# Altium project MiniPC MB GOST.PrjPcb (part 1 of 31)
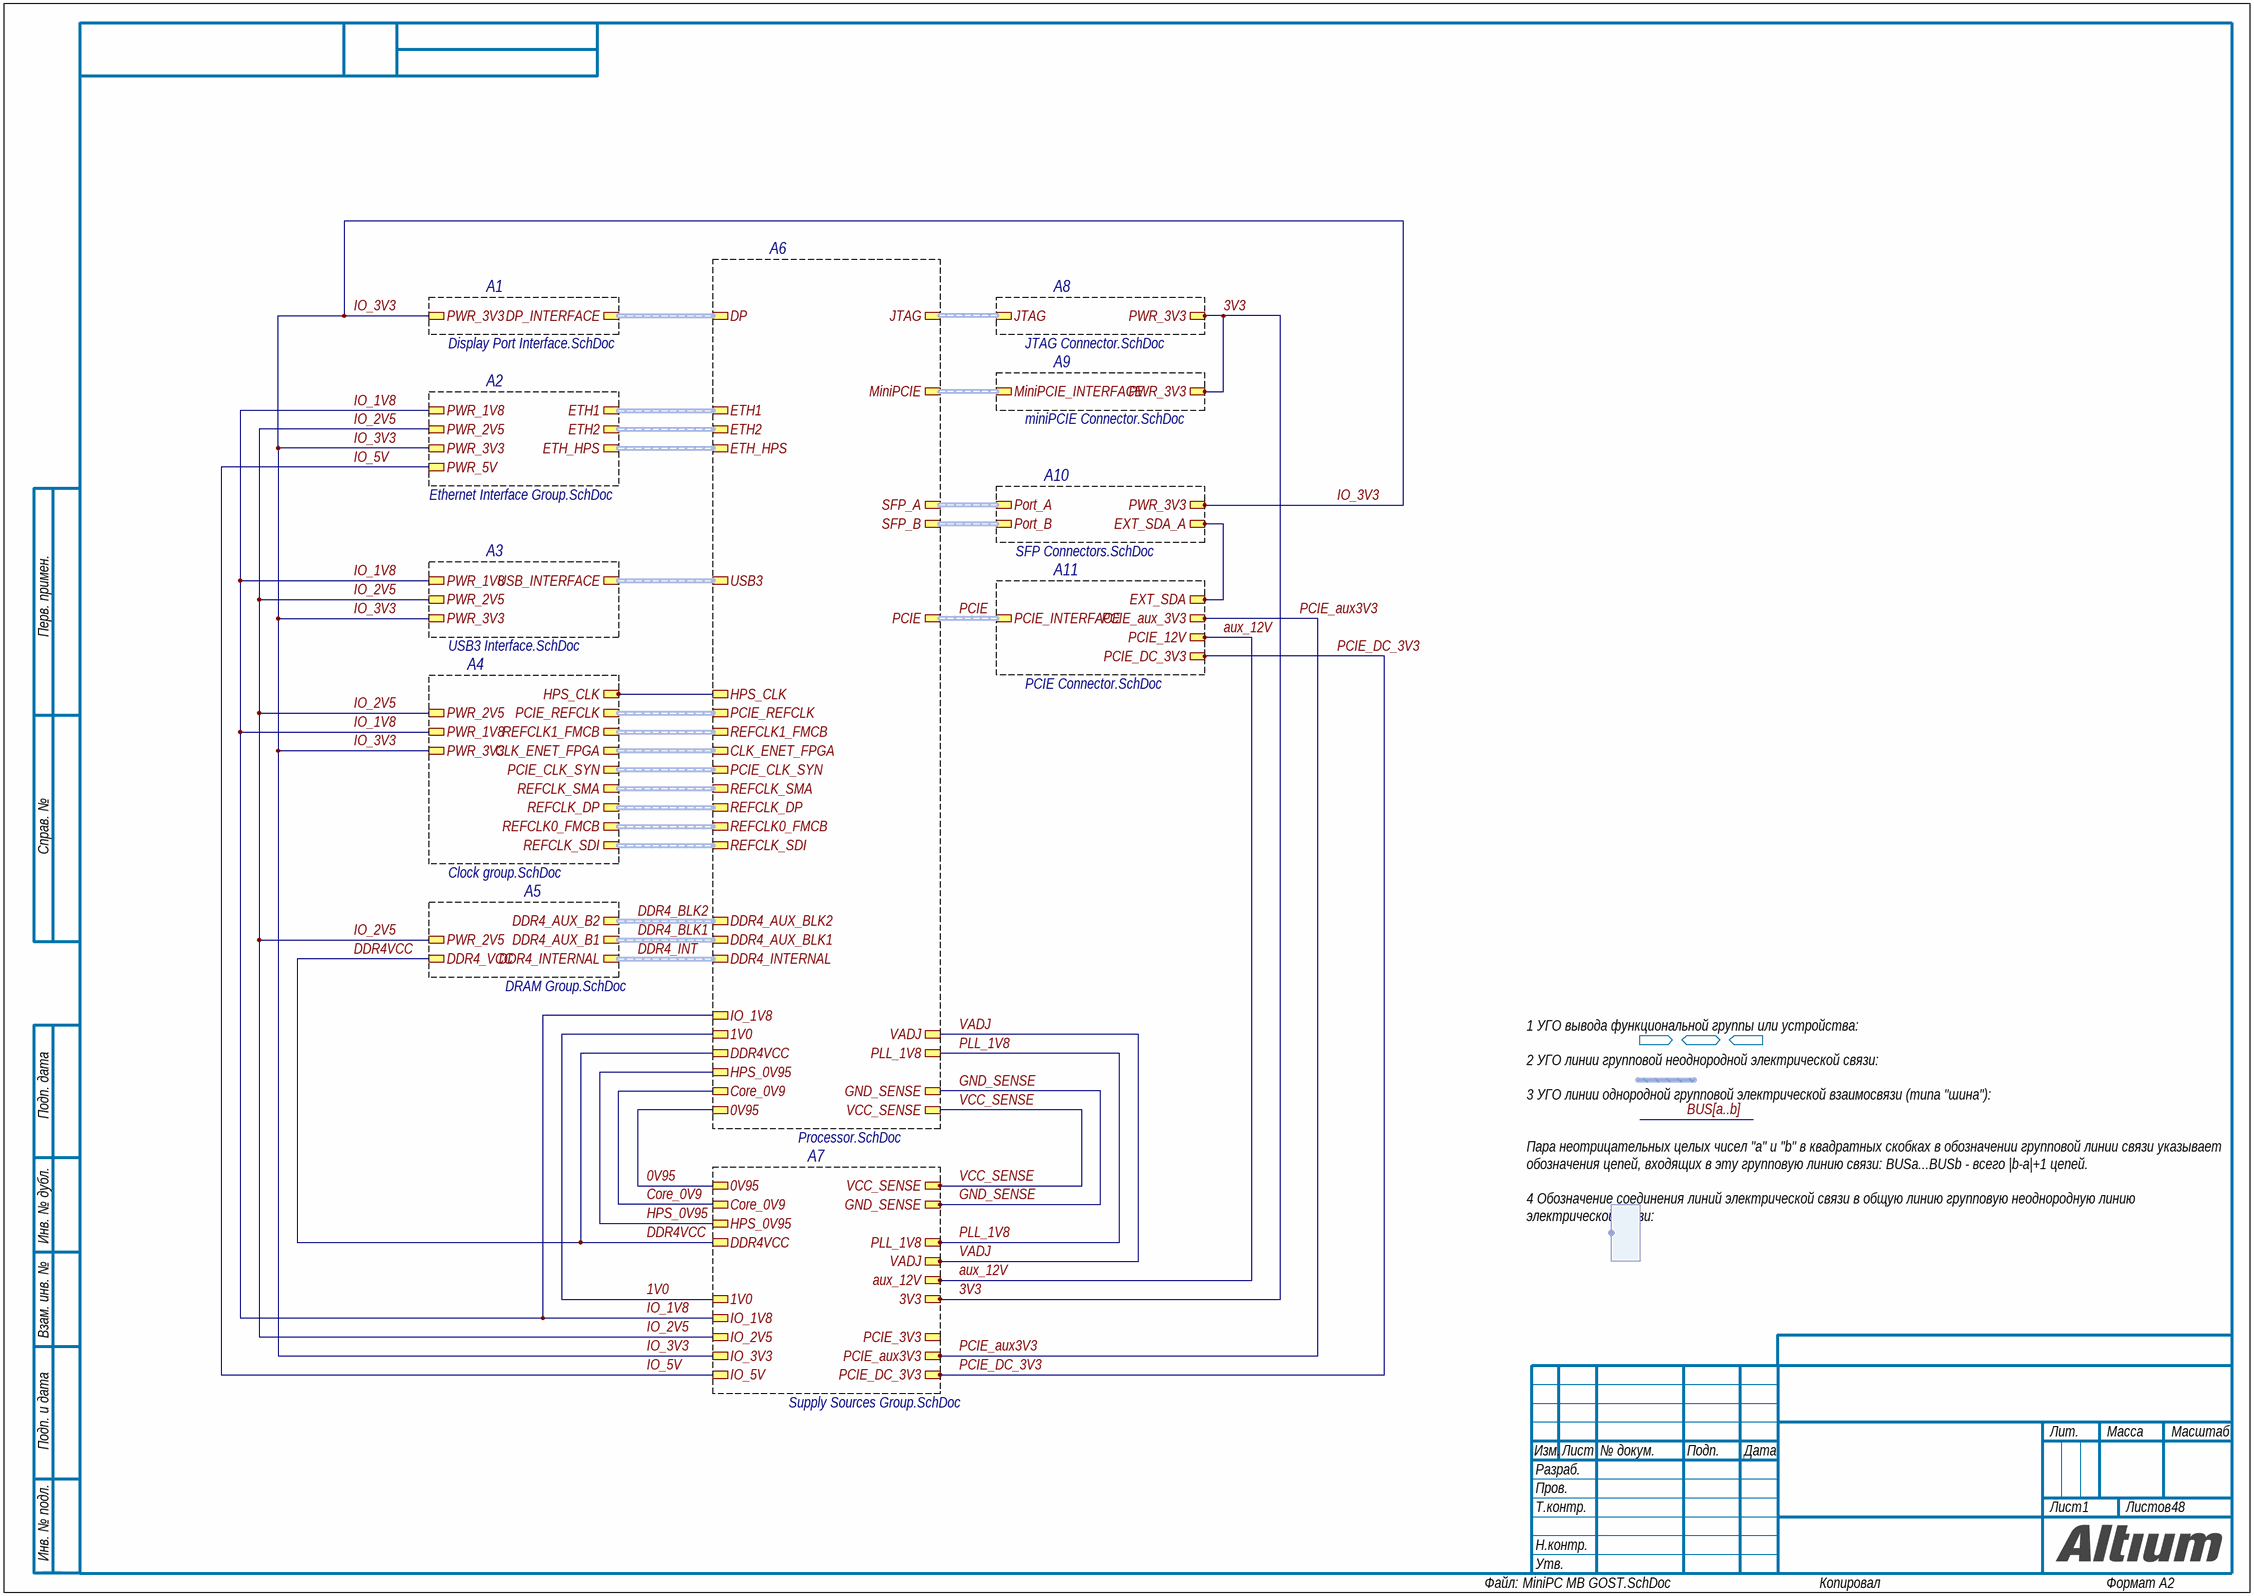
[diagram p0: MiniPC MB GOST.SchDoc]
Âèä_äîêóìåíòà_SCH: Ñõåìà ýëåêòðè÷åñêàÿ ïðèíöèïèàëüíàÿ; Êîä_äîêóìåíòà_SCH: Ý3; Ëèòåðà: Î; Íàèìåíîâàíèå: MiniPC Îñíîâíàÿ ïëàòà; Íàèìåíîâàíèå1: MiniPC Îñíîâíàÿ ïëàòà; Íàèìåíîâàíèå_PCB: MiniPC Îñíîâíàÿ ïëàòà; Обозначение: 495.604.1585; Обозначение_PCB: 495.604.1585; Обозначение_Код: 495.604.1585Ý3; Указания_изменение: -; Указания_изменение_ПЭ3: -; Ôîðìàò_PCB: À4, À3, À2; ï_Í_êîíòð_Ð: Íîðìà÷åâ; ï_Ïðîâ_Ð: Ïðîâåðîâ; ï_Ðàçðàá_Ð: Ðàçðàáîâ; ï_Óòâ_Ð: Óòâåðæäóí
45 sheets, 1002 parts. Net scope: hierarchical (ports join the sheet entries above them; power ports are global).
Board file: MiniPC.PcbDoc
Sheets:
  MiniPC MB GOST.SchDoc
    A5 = DRAM Group.SchDoc
      AB14 = DRAM DDR4 bank 1 Connector.SchDoc
      AB13 = DRAM DDR4.SchDoc
      AB15 = DRAM DDR4 Bank 2 Connector.SchDoc
    A7 = Supply Sources Group.SchDoc
      AB23 = Converter 12V-3V3.SchDoc
      AB32 = Converter 12V-0V9.SchDoc
      AB35 = Converter 12V-5V.SchDoc
      AB24 = Supply Switches 12V 3V3 1V8.SchDoc
      AB34 = Supply Driver 12V.SchDoc
      AB36 = Supply Swithes 2V5-1V8.SchDoc
      AB30 = Converter 3V3-1V8.SchDoc
      AB28 = Converter 3V3-0V9 V1.SchDoc
      AB31 = Converter 3V3-2V5.SchDoc
      AB27 = Converter 3V3-1V.SchDoc
      AB25 = Converter 3V3-VADJ.SchDoc
      AB26 = Converter 3V3-DDR4VCC.SchDoc
      AB33 = Supply Switches for 3V3 externals.SchDoc
      AB29 = Converter 3V3-0V9 V2.SchDoc
    A2 = Ethernet Interface Group.SchDoc
      AB19 = Ethernet Interface.SchDoc
        AC1 = Ethernet Connector.SchDoc
      AB21 = Ethernet HPS Interface.SchDoc
        AC2 = Ethernet HPS Connector.SchDoc
      AB20 = Ethernet Interface.SchDoc
        AC1 = Ethernet Connector.SchDoc
    A8 = JTAG Connector.SchDoc
    A9 = miniPCIE Connector.SchDoc
    A11 = PCIE Connector.SchDoc
    A4 = Clock group.SchDoc
    A1 = Display Port Interface.SchDoc
      AB16 = DisplayPort Connector.SchDoc
    A10 = SFP Connectors.SchDoc
      AB17 = SFP Connector.SchDoc
      AB18 = SFP Connector.SchDoc
    A3 = USB3 Interface.SchDoc
      AB22 = USB3 Connector.SchDoc
  Core Supply Filter.SchDoc
  IO Supply Filter.SchDoc
  P_RAM_integr.SchDoc
  P_RAM_aux.SchDoc
  P_DP_REFCLK_SFP.SchDoc
  P_JTAG_EEPROM.SchDoc
  P_USB.SchDoc
  P_MiniPCIE.SchDoc
  P_PCIE_ETH.SchDoc
  P_ETH_HPS.SchDoc

## Sheet MiniPC MB GOST.SchDoc
size 594 x 420 mm; AdditionFace: Рук.проекта; AdditionFaceBy: Сидоров; StandartControlBy: Смирнов; Letter1: {Э}; DocumentType: Схема электрическая принципиальная; Title1: {Наименование}; Title2: {Наименование}; GroupNumber: {ХХХХ.000000.001-01}; PageSetup: Record=PageOptions|CenterHorizontal=True|CenterVertical=True|PrintScale=1.00|XCorrection=1.00|YCorrection=1.00|PrintKind=2|BorderSize=5000000|LeftOffset=0|BottomOffset=0|Orientation=2|PaperLength=1000|PaperWidth=1000|Scale=100|PaperSource=7|PrintQuality=-3|MediaType=1|DitherType=10|PrintScaleMode=1|PaperKind=A4|PaperIndex=9; Author: ALTIUM GOSTBOM2.0 KEV; SheetNumber: 1; SheetTotal: 48

### Sub-sheets
A1 = Display Port Interface.SchDoc: DP_INTERFACE (harness DP_INTERFACE), PWR_3V3
A2 = Ethernet Interface Group.SchDoc: PWR_1V8, ETH1 (harness ETHERNET), ETH2 (harness ETHERNET), PWR_2V5, PWR_5V, PWR_3V3, ETH_HPS (harness ETHERNET_HPS)
A3 = USB3 Interface.SchDoc: PWR_1V8, USB_INTERFACE (harness USB3), PWR_3V3, PWR_2V5
A4 = Clock group.SchDoc: REFCLK1_FMCB (harness DIFFPAIR), PCIE_REFCLK (harness DIFFPAIR), HPS_CLK, PWR_3V3, CLK_ENET_FPGA (harness DIFFPAIR), PCIE_CLK_SYN (harness DIFFPAIR), REFCLK_SMA (harness DIFFPAIR), REFCLK_DP (harness DIFFPAIR), REFCLK0_FMCB (harness DIFFPAIR), PWR_1V8, REFCLK_SDI (harness DIFFPAIR), PWR_2V5
A5 = DRAM Group.SchDoc: DDR4_INTERNAL (harness DDR4_2C), DDR4_VCC, PWR_2V5, DDR4_AUX_B1 (harness DDR4_SODIMM), DDR4_AUX_B2 (harness DDR4_SODIMM)
A6 = Processor.SchDoc (file not in this document): 0V95, Core_0V9, HPS_0V95, DDR4VCC, 1V0, IO_1V8, VCC_SENSE, GND_SENSE, PLL_1V8, VADJ, DP (harness DP_INTERFACE), ETH1 (harness ETHERNET), ETH2 (harness ETHERNET), ETH_HPS (harness ETHERNET_HPS), PCIE_REFCLK (harness DIFFPAIR), REFCLK1_FMCB (harness DIFFPAIR), CLK_ENET_FPGA (harness DIFFPAIR), PCIE_CLK_SYN (harness DIFFPAIR), REFCLK_SMA (harness DIFFPAIR), REFCLK_DP (harness DIFFPAIR), REFCLK0_FMCB (harness DIFFPAIR), REFCLK_SDI (harness DIFFPAIR), DDR4_AUX_BLK2 (harness DDR4_SODIMM), DDR4_AUX_BLK1 (harness DDR4_SODIMM), DDR4_INTERNAL (harness DDR4_2C), PCIE (harness PCIE), SFP_B (harness SFP), SFP_A (harness SFP), MiniPCIE (harness MiniPCIE), JTAG (harness JTAG), HPS_CLK, USB3 (harness USB3)
A7 = Supply Sources Group.SchDoc: 0V95, PCIE_3V3, VCC_SENSE, GND_SENSE, aux_12V, 1V0, IO_1V8, PLL_1V8, VADJ, PCIE_aux3V3, PCIE_DC_3V3, Core_0V9, IO_2V5, IO_5V, HPS_0V95, DDR4VCC, IO_3V3, 3V3
A8 = JTAG Connector.SchDoc: JTAG (harness JTAG), PWR_3V3
A9 = miniPCIE Connector.SchDoc: PWR_3V3, MiniPCIE_INTERFACE (harness MiniPCIE)
A10 = SFP Connectors.SchDoc: Port_A (harness SFP), EXT_SDA_A, Port_B (harness SFP), PWR_3V3
A11 = PCIE Connector.SchDoc: PCIE_12V, PCIE_DC_3V3, EXT_SDA, PCIE_INTERFACE (harness PCIE), PCIE_aux_3V3

### Harnesses
111: 

### Nets
0V95: sheet A6/0V95, sheet A7/0V95
1V0: sheet A6/1V0, sheet A7/1V0
3V3: sheet A7/3V3, sheet A8/PWR_3V3, sheet A9/PWR_3V3
aux_12V: sheet A7/aux_12V, sheet A11/PCIE_12V
Core_0V9: sheet A6/Core_0V9, sheet A7/Core_0V9
DDR4VCC: sheet A6/DDR4VCC, sheet A5/DDR4_VCC, sheet A7/DDR4VCC
EXT_SDA: sheet A11/EXT_SDA, sheet A10/EXT_SDA_A
GND_SENSE: sheet A6/GND_SENSE, sheet A7/GND_SENSE
HPS_0V95: sheet A6/HPS_0V95, sheet A7/HPS_0V95
IO_1V8: sheet A6/IO_1V8, sheet A7/IO_1V8, sheet A2/PWR_1V8, sheet A4/PWR_1V8, sheet A3/PWR_1V8
IO_2V5: sheet A5/PWR_2V5, sheet A7/IO_2V5, sheet A2/PWR_2V5, sheet A4/PWR_2V5, sheet A3/PWR_2V5
IO_3V3: sheet A7/IO_3V3, sheet A2/PWR_3V3, sheet A4/PWR_3V3, sheet A1/PWR_3V3, sheet A10/PWR_3V3, sheet A3/PWR_3V3
IO_5V: sheet A7/IO_5V, sheet A2/PWR_5V
PCIE_aux3V3: sheet A7/PCIE_aux3V3, sheet A11/PCIE_aux_3V3
PCIE_DC_3V3: sheet A7/PCIE_DC_3V3, sheet A11/PCIE_DC_3V3
PLL_1V8: sheet A6/PLL_1V8, sheet A7/PLL_1V8
VADJ: sheet A6/VADJ, sheet A7/VADJ
VCC_SENSE: sheet A6/VCC_SENSE, sheet A7/VCC_SENSE
NetD5_1: sheet A6/HPS_CLK, sheet A4/HPS_CLK

### Buses and harness runs
bus BUS[a..b]
harness DDR4_BLK1 = sheet A5/DDR4_AUX_B1 = sheet A6/DDR4_AUX_BLK1
harness DDR4_BLK2 = sheet A5/DDR4_AUX_B2 = sheet A6/DDR4_AUX_BLK2
harness DDR4_INT = sheet A5/DDR4_INTERNAL = sheet A6/DDR4_INTERNAL
harness PCIE = sheet A6/PCIE = sheet A11/PCIE_INTERFACE
harness sheet A1/DP_INTERFACE = sheet A6/DP
harness sheet A2/ETH1 = sheet A6/ETH1
harness sheet A2/ETH2 = sheet A6/ETH2
harness sheet A2/ETH_HPS = sheet A6/ETH_HPS
harness sheet A3/USB_INTERFACE = sheet A6/USB3
harness sheet A4/CLK_ENET_FPGA = sheet A6/CLK_ENET_FPGA
harness sheet A4/PCIE_CLK_SYN = sheet A6/PCIE_CLK_SYN
harness sheet A4/PCIE_REFCLK = sheet A6/PCIE_REFCLK
harness sheet A4/REFCLK0_FMCB = sheet A6/REFCLK0_FMCB
harness sheet A4/REFCLK1_FMCB = sheet A6/REFCLK1_FMCB
harness sheet A4/REFCLK_DP = sheet A6/REFCLK_DP
harness sheet A4/REFCLK_SDI = sheet A6/REFCLK_SDI
harness sheet A4/REFCLK_SMA = sheet A6/REFCLK_SMA
harness sheet A6/JTAG = sheet A8/JTAG
harness sheet A6/MiniPCIE = sheet A9/MiniPCIE_INTERFACE
harness sheet A6/SFP_A = sheet A10/Port_A
harness sheet A6/SFP_B = sheet A10/Port_B

### Notes on the sheet
- 1 УГО вывода функциональной группы или устройства:
  2 УГО линии групповой неоднородной электрической связи:
  3 УГО линии однородной групповой электрической взаимосвязи (типа "шина"):
  Пара неотрицательных целых чисел "a" и "b" в квадратных скобках в обозначении групповой линии связи указывает обозначения цепей, входящих в эту групповую линию связи: BUSa...BUSb - всего |b-a|+1 цепей.
  4 Обозначение соединения линий электрической связи в общую линию групповую неоднородную линию электрической связи:
  5 Основная надпись листов схемы по форме 1 ГОСТ 2.104-2006 (согласно п.5.1 ГОСТ 2.104-2006).
- Перв. примен.
- Справ. №
- Подп. дата
- Инв. № дубл.
- Взам. инв. №
- Подп. и дата
- Изм.
- Разраб.
- Лист
- № докум.
- Подп.
- Дата
- Лит.
- Масса
- Масштаб
- Пров.
- Т.контр.
- Листов
- Инв. № подл.
- Н.контр.
- Утв.
- ALTIUM GOSTBOM2.0 KEV
- Файл:
- Копировал
- Формат А2

## Sheet DRAM Group.SchDoc
size 209 x 297 mm; Author: ALTIUM GOSTBOM2.0 KEV; SheetNumber: 5; SheetTotal: 48
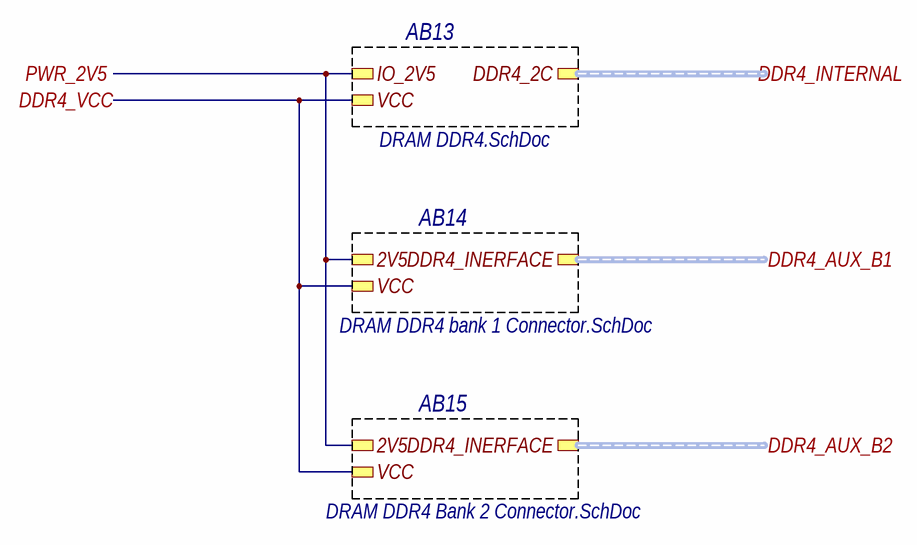
[diagram p1: DRAM Group.SchDoc]

### Sub-sheets
AB13 = DRAM DDR4.SchDoc: VCC, IO_2V5, DDR4_2C (harness DDR4_2C)
AB14 = DRAM DDR4 bank 1 Connector.SchDoc: VCC, DDR4_INERFACE (harness DDR4_SODIMM), 2V5
AB15 = DRAM DDR4 Bank 2 Connector.SchDoc: VCC, DDR4_INERFACE (harness DDR4_SODIMM), 2V5

### Ports
DDR4_AUX_B1 (harness DDR4_SODIMM), DDR4_AUX_B2 (harness DDR4_SODIMM), DDR4_INTERNAL (harness DDR4_2C), DDR4_VCC, PWR_2V5

### Nets
DDR4VCC: port DDR4_VCC, sheet AB14/VCC, sheet AB13/VCC, sheet AB15/VCC
IO_2V5: port PWR_2V5, sheet AB14/2V5, sheet AB13/IO_2V5, sheet AB15/2V5

### Buses and harness runs
harness port DDR4_AUX_B1 = sheet AB14/DDR4_INERFACE
harness port DDR4_AUX_B2 = sheet AB15/DDR4_INERFACE
harness port DDR4_INTERNAL = sheet AB13/DDR4_2C

### Notes on the sheet
- Подп. дата
- Инв. № дубл.
- Взам. инв. №
- Подп. и дата
- Инв. № подл.
- Изм.
- Лист
- № докум.
- Подп.
- Дата
- Файл:
- ALTIUM GOSTBOM2.0 KEV
- Копировал
- Формат А4

## Sheet DRAM DDR4 bank 1 Connector.SchDoc
size 594 x 420 mm; Author: ALTIUM GOSTBOM2.0 KEV; SheetNumber: 6; SheetTotal: 48
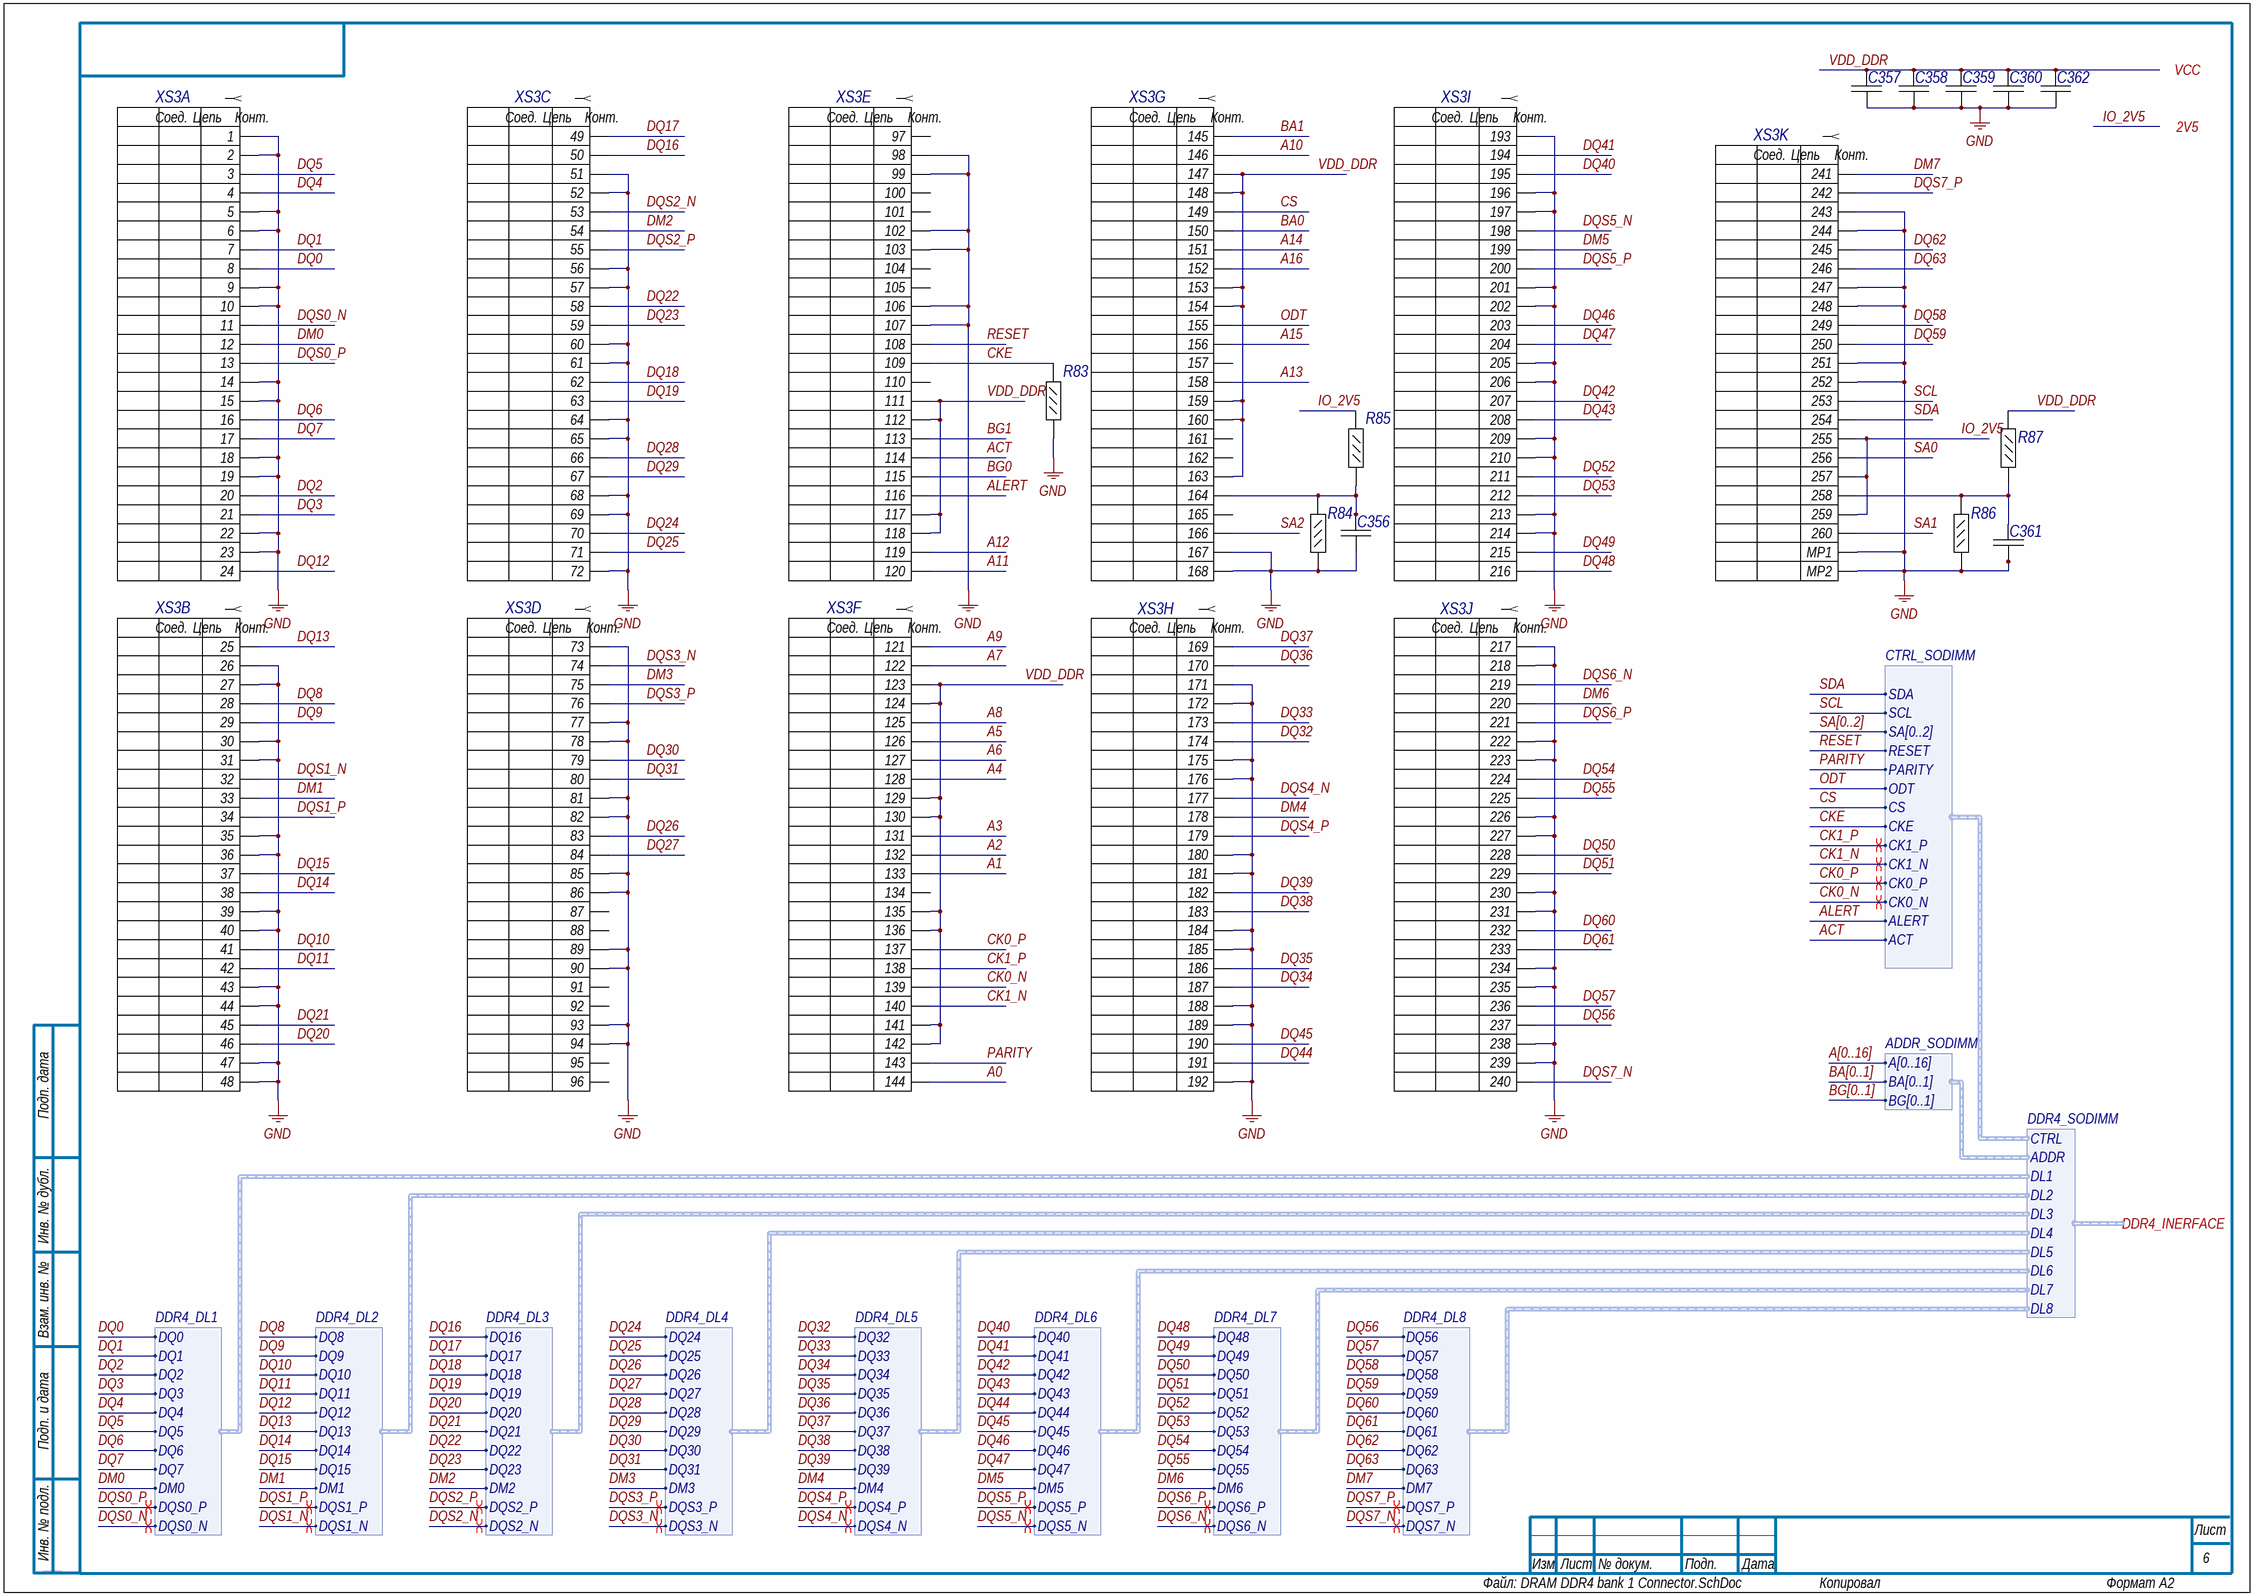
[diagram p2: DRAM DDR4 bank 1 Connector.SchDoc]

### Parts
C356  C1005X7R1E104M  [CAPC1005X55X10LL05]  (value not drawn)
C357  C1005X7R1E104M  [CAPC1005X55X10LL05]  (value not drawn)
C358  C1005X7R1E104M  [CAPC1005X55X10LL05]  (value not drawn)
C359  C1005X7R1E104M  [CAPC1005X55X10LL05]  (value not drawn)
C360  C1005X7R1E104M  [CAPC1005X55X10LL05]  (value not drawn)
C361  C1005X7R1E104M  [CAPC1005X55X10LL05]  (value not drawn)
C362  C1005X7R1E104M  [CAPC1005X55X10LL05]  (value not drawn)
R83  RC0402JR-0739RL  [RESC1005X40X25LL05T05]  (value not drawn)
R84  RC0402JR-0739RL  [RESC1005X40X25LL05T05]  (value not drawn)
R85  RC0402JR-0739RL  [RESC1005X40X25LL05T05]  (value not drawn)
R86  RC0402JR-0739RL  [RESC1005X40X25LL05T05]  (value not drawn)
R87  RC0402JR-0739RL  [RESC1005X40X25LL05T05]  (value not drawn)
XS3  AS0A823-H8SB-7H  [FOXC-AS0A823-H8SB-7H_V]  (value not drawn)  (parts A,B,C,D,E,F,G,H,I,J,K of 11)

### Ports
2V5, DDR4_INERFACE (harness DDR4_SODIMM), VCC

### Harnesses
DDR4_DL1: DQ0, DQ1, DQ2, DQ3, DQ4, DQ5, DQ6, DQ7, DM0, DQS0_P, DQS0_N
DDR4_DL2: DQ8, DQ9, DQ10, DQ11, DQ12, DQ13, DQ14, DQ15, DM1, DQS1_P, DQS1_N
DDR4_DL3: DQ16, DQ17, DQ18, DQ19, DQ20, DQ21, DQ22, DQ23, DM2, DQS2_P, DQS2_N
DDR4_DL4: DQ24, DQ25, DQ26, DQ27, DQ28, DQ29, DQ30, DQ31, DM3, DQS3_P, DQS3_N
DDR4_DL5: DQ32, DQ33, DQ34, DQ35, DQ36, DQ37, DQ38, DQ39, DM4, DQS4_P, DQS4_N
DDR4_DL6: DQ40, DQ41, DQ42, DQ43, DQ44, DQ45, DQ46, DQ47, DM5, DQS5_P, DQS5_N
DDR4_DL7: DQ48, DQ49, DQ50, DQ51, DQ52, DQ53, DQ54, DQ55, DM6, DQS6_P, DQS6_N
DDR4_DL8: DQ56, DQ57, DQ58, DQ59, DQ60, DQ61, DQ62, DQ63, DM7, DQS7_P, DQS7_N
DDR4_SODIMM: CTRL, ADDR, DL1, DL2, DL3, DL4, DL5, DL6, DL7, DL8
ADDR_SODIMM: A[0..16], BA[0..1], BG[0..1]
CTRL_SODIMM: SDA, SCL, SA[0..2], RESET, PARITY, ODT, CS, CKE, CK1_P, CK1_N, CK0_P, CK0_N, ALERT, ACT

### Nets
GND: C356.1 C357.2 C358.2 C359.2 C360.2 C361.2 C362.2 R83.1 R84.1 R86.1 XS3.1 XS3.2 XS3.5 XS3.6 XS3.9 XS3.10 XS3.14 XS3.15 XS3.18 XS3.19 XS3.22 XS3.23 XS3.26 XS3.27 XS3.30 XS3.31 XS3.35 XS3.36 XS3.39 XS3.40 XS3.43 XS3.44 XS3.47 XS3.48 XS3.51 XS3.52 XS3.56 XS3.57 XS3.60 XS3.61 XS3.64 XS3.65 XS3.68 XS3.69 XS3.72 XS3.73 XS3.77 XS3.78 XS3.81 XS3.82 XS3.85 XS3.86 XS3.89 XS3.90 XS3.93 XS3.94 XS3.98 XS3.99 XS3.102 XS3.103 XS3.106 XS3.107 XS3.167 XS3.168 XS3.171 XS3.172 XS3.175 XS3.176 XS3.180 XS3.181 XS3.184 XS3.185 XS3.188 XS3.189 XS3.192 XS3.193 XS3.196 XS3.197 XS3.201 XS3.202 XS3.205 XS3.206 XS3.209 XS3.210 XS3.213 XS3.214 XS3.217 XS3.218 XS3.222 XS3.223 XS3.226 XS3.227 XS3.230 XS3.231 XS3.234 XS3.235 XS3.238 XS3.239 XS3.243 XS3.244 XS3.247 XS3.248 XS3.251 XS3.252 XS3.MP1 XS3.MP2
A0: XS3.144  [project net A0_6]
A1: XS3.133  [project net A1_6]
A2: XS3.132  [project net A2_6]
A3: XS3.131  [project net A3_6]
A4: XS3.128  [project net A4_6]
A5: XS3.126  [project net A5_6]
A6: XS3.127  [project net A6_6]
A7: XS3.122  [project net A7_6]
A8: XS3.125  [project net A8_6]
A9: XS3.121  [project net A9_6]
A10: XS3.146  [project net A10_6]
A11: XS3.120  [project net A11_6]
A12: XS3.119  [project net A12_6]
A13: XS3.158  [project net A13_6]
A14: XS3.151  [project net A14_6]
A15: XS3.156  [project net A15_6]
A16: XS3.152  [project net A16_6]
ACT: XS3.114 ; harness CTRL_SODIMM.ACT
ALERT: XS3.116 ; harness CTRL_SODIMM.ALERT
BA0: XS3.150  [project net BA0_6]
BA1: XS3.145  [project net BA1_6]
BG0: XS3.115  [project net BG0_6]
BG1: XS3.113  [project net BG1_6]
CK0_N: XS3.139 ; harness CTRL_SODIMM.CK0_N
CK0_P: XS3.137 ; harness CTRL_SODIMM.CK0_P
CK1_N: XS3.140 ; harness CTRL_SODIMM.CK1_N
CK1_P: XS3.138 ; harness CTRL_SODIMM.CK1_P
CKE: R83.2 XS3.109 ; harness CTRL_SODIMM.CKE
CS: XS3.149 ; harness CTRL_SODIMM.CS
DM0: XS3.12 ; harness DDR4_DL1.DM0
DM1: XS3.33 ; harness DDR4_DL2.DM1
DM2: XS3.54 ; harness DDR4_DL3.DM2
DM3: XS3.75 ; harness DDR4_DL4.DM3
DM4: XS3.178 ; harness DDR4_DL5.DM4
DM5: XS3.199 ; harness DDR4_DL6.DM5
DM6: XS3.220 ; harness DDR4_DL7.DM6
DM7: XS3.241 ; harness DDR4_DL8.DM7
DQ0: XS3.8 ; harness DDR4_DL1.DQ0
DQ1: XS3.7 ; harness DDR4_DL1.DQ1
DQ2: XS3.20 ; harness DDR4_DL1.DQ2
DQ3: XS3.21 ; harness DDR4_DL1.DQ3
DQ4: XS3.4 ; harness DDR4_DL1.DQ4
DQ5: XS3.3 ; harness DDR4_DL1.DQ5
DQ6: XS3.16 ; harness DDR4_DL1.DQ6
DQ7: XS3.17 ; harness DDR4_DL1.DQ7
DQ8: XS3.28 ; harness DDR4_DL2.DQ8
DQ9: XS3.29 ; harness DDR4_DL2.DQ9
DQ10: XS3.41 ; harness DDR4_DL2.DQ10
DQ11: XS3.42 ; harness DDR4_DL2.DQ11
DQ12: XS3.24 ; harness DDR4_DL2.DQ12
DQ13: XS3.25 ; harness DDR4_DL2.DQ13
DQ14: XS3.38 ; harness DDR4_DL2.DQ14
DQ15: XS3.37 ; harness DDR4_DL2.DQ15
DQ16: XS3.50 ; harness DDR4_DL3.DQ16
DQ17: XS3.49 ; harness DDR4_DL3.DQ17
DQ18: XS3.62 ; harness DDR4_DL3.DQ18
DQ19: XS3.63 ; harness DDR4_DL3.DQ19
DQ20: XS3.46 ; harness DDR4_DL3.DQ20
DQ21: XS3.45 ; harness DDR4_DL3.DQ21
DQ22: XS3.58 ; harness DDR4_DL3.DQ22
DQ23: XS3.59 ; harness DDR4_DL3.DQ23
DQ24: XS3.70 ; harness DDR4_DL4.DQ24
DQ25: XS3.71 ; harness DDR4_DL4.DQ25
DQ26: XS3.83 ; harness DDR4_DL4.DQ26
DQ27: XS3.84 ; harness DDR4_DL4.DQ27
DQ28: XS3.66 ; harness DDR4_DL4.DQ28
DQ29: XS3.67 ; harness DDR4_DL4.DQ29
DQ30: XS3.79 ; harness DDR4_DL4.DQ30
DQ31: XS3.80 ; harness DDR4_DL4.DQ31
DQ32: XS3.174 ; harness DDR4_DL5.DQ32
DQ33: XS3.173 ; harness DDR4_DL5.DQ33
DQ34: XS3.187 ; harness DDR4_DL5.DQ34
DQ35: XS3.186 ; harness DDR4_DL5.DQ35
DQ36: XS3.170 ; harness DDR4_DL5.DQ36
DQ37: XS3.169 ; harness DDR4_DL5.DQ37
DQ38: XS3.183 ; harness DDR4_DL5.DQ38
DQ39: XS3.182 ; harness DDR4_DL5.DQ39
DQ40: XS3.195 ; harness DDR4_DL6.DQ40
DQ41: XS3.194 ; harness DDR4_DL6.DQ41
DQ42: XS3.207 ; harness DDR4_DL6.DQ42
DQ43: XS3.208 ; harness DDR4_DL6.DQ43
DQ44: XS3.191 ; harness DDR4_DL6.DQ44
DQ45: XS3.190 ; harness DDR4_DL6.DQ45
DQ46: XS3.203 ; harness DDR4_DL6.DQ46
DQ47: XS3.204 ; harness DDR4_DL6.DQ47
DQ48: XS3.216 ; harness DDR4_DL7.DQ48
DQ49: XS3.215 ; harness DDR4_DL7.DQ49
DQ50: XS3.228 ; harness DDR4_DL7.DQ50
DQ51: XS3.229 ; harness DDR4_DL7.DQ51
DQ52: XS3.211 ; harness DDR4_DL7.DQ52
DQ53: XS3.212 ; harness DDR4_DL7.DQ53
DQ54: XS3.224 ; harness DDR4_DL7.DQ54
DQ55: XS3.225 ; harness DDR4_DL7.DQ55
DQ56: XS3.237 ; harness DDR4_DL8.DQ56
DQ57: XS3.236 ; harness DDR4_DL8.DQ57
DQ58: XS3.249 ; harness DDR4_DL8.DQ58
DQ59: XS3.250 ; harness DDR4_DL8.DQ59
DQ60: XS3.232 ; harness DDR4_DL8.DQ60
DQ61: XS3.233 ; harness DDR4_DL8.DQ61
DQ62: XS3.245 ; harness DDR4_DL8.DQ62
DQ63: XS3.246 ; harness DDR4_DL8.DQ63
DQS0_N: XS3.11 ; harness DDR4_DL1.DQS0_N
DQS0_P: XS3.13 ; harness DDR4_DL1.DQS0_P
DQS1_N: XS3.32 ; harness DDR4_DL2.DQS1_N
DQS1_P: XS3.34 ; harness DDR4_DL2.DQS1_P
DQS2_N: XS3.53 ; harness DDR4_DL3.DQS2_N
DQS2_P: XS3.55 ; harness DDR4_DL3.DQS2_P
DQS3_N: XS3.74 ; harness DDR4_DL4.DQS3_N
DQS3_P: XS3.76 ; harness DDR4_DL4.DQS3_P
DQS4_N: XS3.177 ; harness DDR4_DL5.DQS4_N
DQS4_P: XS3.179 ; harness DDR4_DL5.DQS4_P
DQS5_N: XS3.198 ; harness DDR4_DL6.DQS5_N
DQS5_P: XS3.200 ; harness DDR4_DL6.DQS5_P
DQS6_N: XS3.219 ; harness DDR4_DL7.DQS6_N
DQS6_P: XS3.221 ; harness DDR4_DL7.DQS6_P
DQS7_N: XS3.240 ; harness DDR4_DL8.DQS7_N
DQS7_P: XS3.242 ; harness DDR4_DL8.DQS7_P
IO_2V5: R85.1 XS3.255 XS3.257 XS3.259 ; port 2V5
ODT: XS3.155 ; harness CTRL_SODIMM.ODT
PARITY: XS3.143 ; harness CTRL_SODIMM.PARITY
RESET: XS3.108 ; harness CTRL_SODIMM.RESET
SA0: XS3.256  [project net SA0_6]
SA1: XS3.260  [project net SA1_6]
SA2: XS3.166  [project net SA2_6]
SCL: XS3.253 ; harness CTRL_SODIMM.SCL
SDA: XS3.254 ; harness CTRL_SODIMM.SDA
VDD_DDR: C357.1 C358.1 C359.1 C360.1 C362.1 R87.1 XS3.111 XS3.112 XS3.117 XS3.118 XS3.123 XS3.124 XS3.129 XS3.130 XS3.135 XS3.136 XS3.141 XS3.142 XS3.147 XS3.148 XS3.153 XS3.154 XS3.159 XS3.160 XS3.163 ; port VCC  [project net DDR4VCC]
NetC356_2: C356.2 R84.2 R85.2 XS3.164
NetC361_1: C361.1 R86.2 R87.2 XS3.258

Not connected (* = marked no-connect by the designer): XS3 87 88 91 92 95 96 97 100 101 104 105 110 134 157 161 162 165

### Buses and harness runs
bus A[0..16]
bus BA[0..1]
bus BG[0..1]
bus SA[0..2]

### Layout directives
differential pair: CK0_N, CK0_P, CK1_N, CK1_P, DQS0_N, DQS0_P, DQS1_N, DQS1_P, DQS2_N, DQS2_P, DQS3_N, DQS3_P, DQS4_N, DQS4_P, DQS5_N, DQS5_P, DQS6_N, DQS6_P, DQS7_N, DQS7_P

### Notes on the sheet
- Подп. дата
- Инв. № дубл.
- Взам. инв. №
- Подп. и дата
- Инв. № подл.
- Изм.
- Лист
- № докум.
- Подп.
- Дата
- ALTIUM GOSTBOM2.0 KEV
- Файл:
- Копировал
- Формат А2
- (in symbol E36, part A) Соед.; Цепь; Конт.
- (in symbol E36, part B) Соед.; Цепь; Конт.
- (in symbol E36, part C) Соед.; Цепь; Конт.
- (in symbol E36, part D) Соед.; Цепь; Конт.
- (in symbol E36, part E) Соед.; Цепь; Конт.
- (in symbol E36, part F) Соед.; Цепь; Конт.
- (in symbol E36, part G) Соед.; Цепь; Конт.
- (in symbol E36, part H) Соед.; Цепь; Конт.
- (in symbol E36, part I) Соед.; Цепь; Конт.
- (in symbol E36, part J) Соед.; Цепь; Конт.
- (in symbol E36, part K) Соед.; Цепь; Конт.

### Library data of the parts
C356 = E11: Chip Capacitor, 0.1 uF, +/- 20%, 25 V, -55 to 125 degC, 0402 (1005 Metric), RoHS, Tape and Reel; Тип элемента: Конденсатор; Capacitance: 100 nF; Case\/Package: 0402; Type (Capacitors): X7R; Voltage Rating: 25 V; Old_des: C288; New_des: C356; UID: E11; Component Kind: Standard; Case Code (Imperial): 0402; Case Code (Metric): 1005; ComponentLink1Description: Manufacturer URL; ComponentLink1URL: http://www.tdk.com/; ComponentLink2Description: Datasheet; ComponentLink2URL: http://www.farnell.com/datasheets/1571323.pdf; DatasheetVersion: 09/2011; Length: 1 mm; Max Operating Temperature: 125 degC; Min Operating Temperature: -55 degC; Mounting Technology: Surface Mount; Package Quantity: 10000; PackageDescription: 2-Pin Surface Mount Device, Body 1 x 0.5 mm; Packaging: Tape and Reel; PartNumber: C1005X7R1E104M; RoHSCompliant: true; Tolerance: 20%; Width: 0.5 mm; Height: 0.5 mm; Mount: Surface Mount; PackageReference: 0402; Pins: 2; Voltage Rating (DC): 25 V
C357 = E11: Chip Capacitor, 0.1 uF, +/- 20%, 25 V, -55 to 125 degC, 0402 (1005 Metric), RoHS, Tape and Reel; Тип элемента: Конденсатор; Capacitance: 100 nF; Case\/Package: 0402; Type (Capacitors): X7R; Voltage Rating: 25 V; Old_des: C283; New_des: C357; UID: E11; Component Kind: Standard; Case Code (Imperial): 0402; Case Code (Metric): 1005; ComponentLink1Description: Manufacturer URL; ComponentLink1URL: http://www.tdk.com/; ComponentLink2Description: Datasheet; ComponentLink2URL: http://www.farnell.com/datasheets/1571323.pdf; DatasheetVersion: 09/2011; Length: 1 mm; Max Operating Temperature: 125 degC; Min Operating Temperature: -55 degC; Mounting Technology: Surface Mount; Package Quantity: 10000; PackageDescription: 2-Pin Surface Mount Device, Body 1 x 0.5 mm; Packaging: Tape and Reel; PartNumber: C1005X7R1E104M; RoHSCompliant: true; Tolerance: 20%; Width: 0.5 mm; Height: 0.5 mm; Mount: Surface Mount; PackageReference: 0402; Pins: 2; Voltage Rating (DC): 25 V
C358 = E11: Chip Capacitor, 0.1 uF, +/- 20%, 25 V, -55 to 125 degC, 0402 (1005 Metric), RoHS, Tape and Reel; Тип элемента: Конденсатор; Capacitance: 100 nF; Case\/Package: 0402; Type (Capacitors): X7R; Voltage Rating: 25 V; Old_des: C284; New_des: C358; UID: E11; Component Kind: Standard; Case Code (Imperial): 0402; Case Code (Metric): 1005; ComponentLink1Description: Manufacturer URL; ComponentLink1URL: http://www.tdk.com/; ComponentLink2Description: Datasheet; ComponentLink2URL: http://www.farnell.com/datasheets/1571323.pdf; DatasheetVersion: 09/2011; Length: 1 mm; Max Operating Temperature: 125 degC; Min Operating Temperature: -55 degC; Mounting Technology: Surface Mount; Package Quantity: 10000; PackageDescription: 2-Pin Surface Mount Device, Body 1 x 0.5 mm; Packaging: Tape and Reel; PartNumber: C1005X7R1E104M; RoHSCompliant: true; Tolerance: 20%; Width: 0.5 mm; Height: 0.5 mm; Mount: Surface Mount; PackageReference: 0402; Pins: 2; Voltage Rating (DC): 25 V
C359 = E11: Chip Capacitor, 0.1 uF, +/- 20%, 25 V, -55 to 125 degC, 0402 (1005 Metric), RoHS, Tape and Reel; Тип элемента: Конденсатор; Capacitance: 100 nF; Case\/Package: 0402; Type (Capacitors): X7R; Voltage Rating: 25 V; Old_des: C285; New_des: C359; UID: E11; Component Kind: Standard; Case Code (Imperial): 0402; Case Code (Metric): 1005; ComponentLink1Description: Manufacturer URL; ComponentLink1URL: http://www.tdk.com/; ComponentLink2Description: Datasheet; ComponentLink2URL: http://www.farnell.com/datasheets/1571323.pdf; DatasheetVersion: 09/2011; Length: 1 mm; Max Operating Temperature: 125 degC; Min Operating Temperature: -55 degC; Mounting Technology: Surface Mount; Package Quantity: 10000; PackageDescription: 2-Pin Surface Mount Device, Body 1 x 0.5 mm; Packaging: Tape and Reel; PartNumber: C1005X7R1E104M; RoHSCompliant: true; Tolerance: 20%; Width: 0.5 mm; Height: 0.5 mm; Mount: Surface Mount; PackageReference: 0402; Pins: 2; Voltage Rating (DC): 25 V
C360 = E11: Chip Capacitor, 0.1 uF, +/- 20%, 25 V, -55 to 125 degC, 0402 (1005 Metric), RoHS, Tape and Reel; Тип элемента: Конденсатор; Capacitance: 100 nF; Case\/Package: 0402; Type (Capacitors): X7R; Voltage Rating: 25 V; Old_des: C286; New_des: C360; UID: E11; Component Kind: Standard; Case Code (Imperial): 0402; Case Code (Metric): 1005; ComponentLink1Description: Manufacturer URL; ComponentLink1URL: http://www.tdk.com/; ComponentLink2Description: Datasheet; ComponentLink2URL: http://www.farnell.com/datasheets/1571323.pdf; DatasheetVersion: 09/2011; Length: 1 mm; Max Operating Temperature: 125 degC; Min Operating Temperature: -55 degC; Mounting Technology: Surface Mount; Package Quantity: 10000; PackageDescription: 2-Pin Surface Mount Device, Body 1 x 0.5 mm; Packaging: Tape and Reel; PartNumber: C1005X7R1E104M; RoHSCompliant: true; Tolerance: 20%; Width: 0.5 mm; Height: 0.5 mm; Mount: Surface Mount; PackageReference: 0402; Pins: 2; Voltage Rating (DC): 25 V
C361 = E11: Chip Capacitor, 0.1 uF, +/- 20%, 25 V, -55 to 125 degC, 0402 (1005 Metric), RoHS, Tape and Reel; Тип элемента: Конденсатор; Capacitance: 100 nF; Case\/Package: 0402; Type (Capacitors): X7R; Voltage Rating: 25 V; Old_des: C289; New_des: C361; UID: E11; Component Kind: Standard; Case Code (Imperial): 0402; Case Code (Metric): 1005; ComponentLink1Description: Manufacturer URL; ComponentLink1URL: http://www.tdk.com/; ComponentLink2Description: Datasheet; ComponentLink2URL: http://www.farnell.com/datasheets/1571323.pdf; DatasheetVersion: 09/2011; Length: 1 mm; Max Operating Temperature: 125 degC; Min Operating Temperature: -55 degC; Mounting Technology: Surface Mount; Package Quantity: 10000; PackageDescription: 2-Pin Surface Mount Device, Body 1 x 0.5 mm; Packaging: Tape and Reel; PartNumber: C1005X7R1E104M; RoHSCompliant: true; Tolerance: 20%; Width: 0.5 mm; Height: 0.5 mm; Mount: Surface Mount; PackageReference: 0402; Pins: 2; Voltage Rating (DC): 25 V
C362 = E11: Chip Capacitor, 0.1 uF, +/- 20%, 25 V, -55 to 125 degC, 0402 (1005 Metric), RoHS, Tape and Reel; Тип элемента: Конденсатор; Capacitance: 100 nF; Case\/Package: 0402; Type (Capacitors): X7R; Voltage Rating: 25 V; Old_des: C287; New_des: C362; UID: E11; Component Kind: Standard; Case Code (Imperial): 0402; Case Code (Metric): 1005; ComponentLink1Description: Manufacturer URL; ComponentLink1URL: http://www.tdk.com/; ComponentLink2Description: Datasheet; ComponentLink2URL: http://www.farnell.com/datasheets/1571323.pdf; DatasheetVersion: 09/2011; Length: 1 mm; Max Operating Temperature: 125 degC; Min Operating Temperature: -55 degC; Mounting Technology: Surface Mount; Package Quantity: 10000; PackageDescription: 2-Pin Surface Mount Device, Body 1 x 0.5 mm; Packaging: Tape and Reel; PartNumber: C1005X7R1E104M; RoHSCompliant: true; Tolerance: 20%; Width: 0.5 mm; Height: 0.5 mm; Mount: Surface Mount; PackageReference: 0402; Pins: 2; Voltage Rating (DC): 25 V
R83 = E97: Chip Resistor, 39 Ohm, +/- 5%, 0.063 W, -55 to 155 degC, 0402 (1005 Metric), RoHS, Tape and Reel; Тип элемента: Резистор; Voltage Rating: 50 V; Power Rating: 63 mW; Resistance: 39 Ohm; Old_des: R231; New_des: R83; UID: E97; Component Kind: Standard; Case Code (Imperial): 0402; Case Code (Metric): 1005; Case/Package: 0402; ComponentLink1Description: Manufacturer URL; ComponentLink1URL: http://www.yageo.com/; ComponentLink2Description: Datasheet; ComponentLink2URL: http://www.yageo.com/documents/recent/PYu-RC_Group_51_RoHS_L_04.pdf; DatasheetVersion: Rev. 4, 02/2016; Length: 1 mm; Max Operating Temperature: 155 degC; Min Operating Temperature: -55 degC; Mounting Technology: Surface Mount; Package Quantity: 1; PackageDescription: 2-Pin Surface Mount Device, Body 1 x 0.5 mm; Packaging: Cut Tape; PartNumber: RC0402JR-0739RL; RoHSCompliant: true; Tolerance: 5%; Width: 0.5 mm; Height: 0.35 mm; Mount: Surface Mount; Pins: 2; REACH SVHC: No SVHC; Voltage Rating (DC): 50 V
R84 = E97: Chip Resistor, 39 Ohm, +/- 5%, 0.063 W, -55 to 155 degC, 0402 (1005 Metric), RoHS, Tape and Reel; Тип элемента: Резистор; Voltage Rating: 50 V; Power Rating: 63 mW; Resistance: 39 Ohm; Old_des: R228; New_des: R84; UID: E97; Component Kind: Standard; Case Code (Imperial): 0402; Case Code (Metric): 1005; Case/Package: 0402; ComponentLink1Description: Manufacturer URL; ComponentLink1URL: http://www.yageo.com/; ComponentLink2Description: Datasheet; ComponentLink2URL: http://www.yageo.com/documents/recent/PYu-RC_Group_51_RoHS_L_04.pdf; DatasheetVersion: Rev. 4, 02/2016; Length: 1 mm; Max Operating Temperature: 155 degC; Min Operating Temperature: -55 degC; Mounting Technology: Surface Mount; Package Quantity: 1; PackageDescription: 2-Pin Surface Mount Device, Body 1 x 0.5 mm; Packaging: Cut Tape; PartNumber: RC0402JR-0739RL; RoHSCompliant: true; Tolerance: 5%; Width: 0.5 mm; Height: 0.35 mm; Mount: Surface Mount; Pins: 2; REACH SVHC: No SVHC; Voltage Rating (DC): 50 V
R85 = E97: Chip Resistor, 39 Ohm, +/- 5%, 0.063 W, -55 to 155 degC, 0402 (1005 Metric), RoHS, Tape and Reel; Тип элемента: Резистор; Voltage Rating: 50 V; Power Rating: 63 mW; Resistance: 39 Ohm; Old_des: R227; New_des: R85; UID: E97; Component Kind: Standard; Case Code (Imperial): 0402; Case Code (Metric): 1005; Case/Package: 0402; ComponentLink1Description: Manufacturer URL; ComponentLink1URL: http://www.yageo.com/; ComponentLink2Description: Datasheet; ComponentLink2URL: http://www.yageo.com/documents/recent/PYu-RC_Group_51_RoHS_L_04.pdf; DatasheetVersion: Rev. 4, 02/2016; Length: 1 mm; Max Operating Temperature: 155 degC; Min Operating Temperature: -55 degC; Mounting Technology: Surface Mount; Package Quantity: 1; PackageDescription: 2-Pin Surface Mount Device, Body 1 x 0.5 mm; Packaging: Cut Tape; PartNumber: RC0402JR-0739RL; RoHSCompliant: true; Tolerance: 5%; Width: 0.5 mm; Height: 0.35 mm; Mount: Surface Mount; Pins: 2; REACH SVHC: No SVHC; Voltage Rating (DC): 50 V
R86 = E97: Chip Resistor, 39 Ohm, +/- 5%, 0.063 W, -55 to 155 degC, 0402 (1005 Metric), RoHS, Tape and Reel; Тип элемента: Резистор; Voltage Rating: 50 V; Power Rating: 63 mW; Resistance: 39 Ohm; Old_des: R230; New_des: R86; UID: E97; Component Kind: Standard; Case Code (Imperial): 0402; Case Code (Metric): 1005; Case/Package: 0402; ComponentLink1Description: Manufacturer URL; ComponentLink1URL: http://www.yageo.com/; ComponentLink2Description: Datasheet; ComponentLink2URL: http://www.yageo.com/documents/recent/PYu-RC_Group_51_RoHS_L_04.pdf; DatasheetVersion: Rev. 4, 02/2016; Length: 1 mm; Max Operating Temperature: 155 degC; Min Operating Temperature: -55 degC; Mounting Technology: Surface Mount; Package Quantity: 1; PackageDescription: 2-Pin Surface Mount Device, Body 1 x 0.5 mm; Packaging: Cut Tape; PartNumber: RC0402JR-0739RL; RoHSCompliant: true; Tolerance: 5%; Width: 0.5 mm; Height: 0.35 mm; Mount: Surface Mount; Pins: 2; REACH SVHC: No SVHC; Voltage Rating (DC): 50 V
R87 = E97: Chip Resistor, 39 Ohm, +/- 5%, 0.063 W, -55 to 155 degC, 0402 (1005 Metric), RoHS, Tape and Reel; Тип элемента: Резистор; Voltage Rating: 50 V; Power Rating: 63 mW; Resistance: 39 Ohm; Old_des: R229; New_des: R87; UID: E97; Component Kind: Standard; Case Code (Imperial): 0402; Case Code (Metric): 1005; Case/Package: 0402; ComponentLink1Description: Manufacturer URL; ComponentLink1URL: http://www.yageo.com/; ComponentLink2Description: Datasheet; ComponentLink2URL: http://www.yageo.com/documents/recent/PYu-RC_Group_51_RoHS_L_04.pdf; DatasheetVersion: Rev. 4, 02/2016; Length: 1 mm; Max Operating Temperature: 155 degC; Min Operating Temperature: -55 degC; Mounting Technology: Surface Mount; Package Quantity: 1; PackageDescription: 2-Pin Surface Mount Device, Body 1 x 0.5 mm; Packaging: Cut Tape; PartNumber: RC0402JR-0739RL; RoHSCompliant: true; Tolerance: 5%; Width: 0.5 mm; Height: 0.35 mm; Mount: Surface Mount; Pins: 2; REACH SVHC: No SVHC; Voltage Rating (DC): 50 V
XS3 = E36: Surface Mount Horizontal Type DDR4 DIMM Socket Connector, 260 Position, Pitch 0.5 mm, -55 to 85 degC, Halogen/Lead Free, Tape and Reel; Тип элемента: Соединитель; Old_des: J8; New_des: XS3; UID: E36; Component Kind: Standard; ComponentLink1Description: Manufacturer URL; ComponentLink1URL: http://www.foxconn.com/; ComponentLink2Description: Datasheet; ComponentLink2URL: https://drive.google.com/drive/folders/0By4GUdJb-DJ9Um5lRWw4YjB4d2c; DatasheetVersion: Rev. A, 10/2013; Mounting Technology: Surface Mount; PackageDescription: 260-Pin Surface Mount Device, Body Length 73.1 mm, Pitch 0.5 mm; PartNumber: AS0A823-H8SB-7H; System: Connector

## Sheet DRAM DDR4.SchDoc
size 594 x 420 mm; Author: ALTIUM GOSTBOM2.0 KEV; SheetNumber: 8; SheetTotal: 48
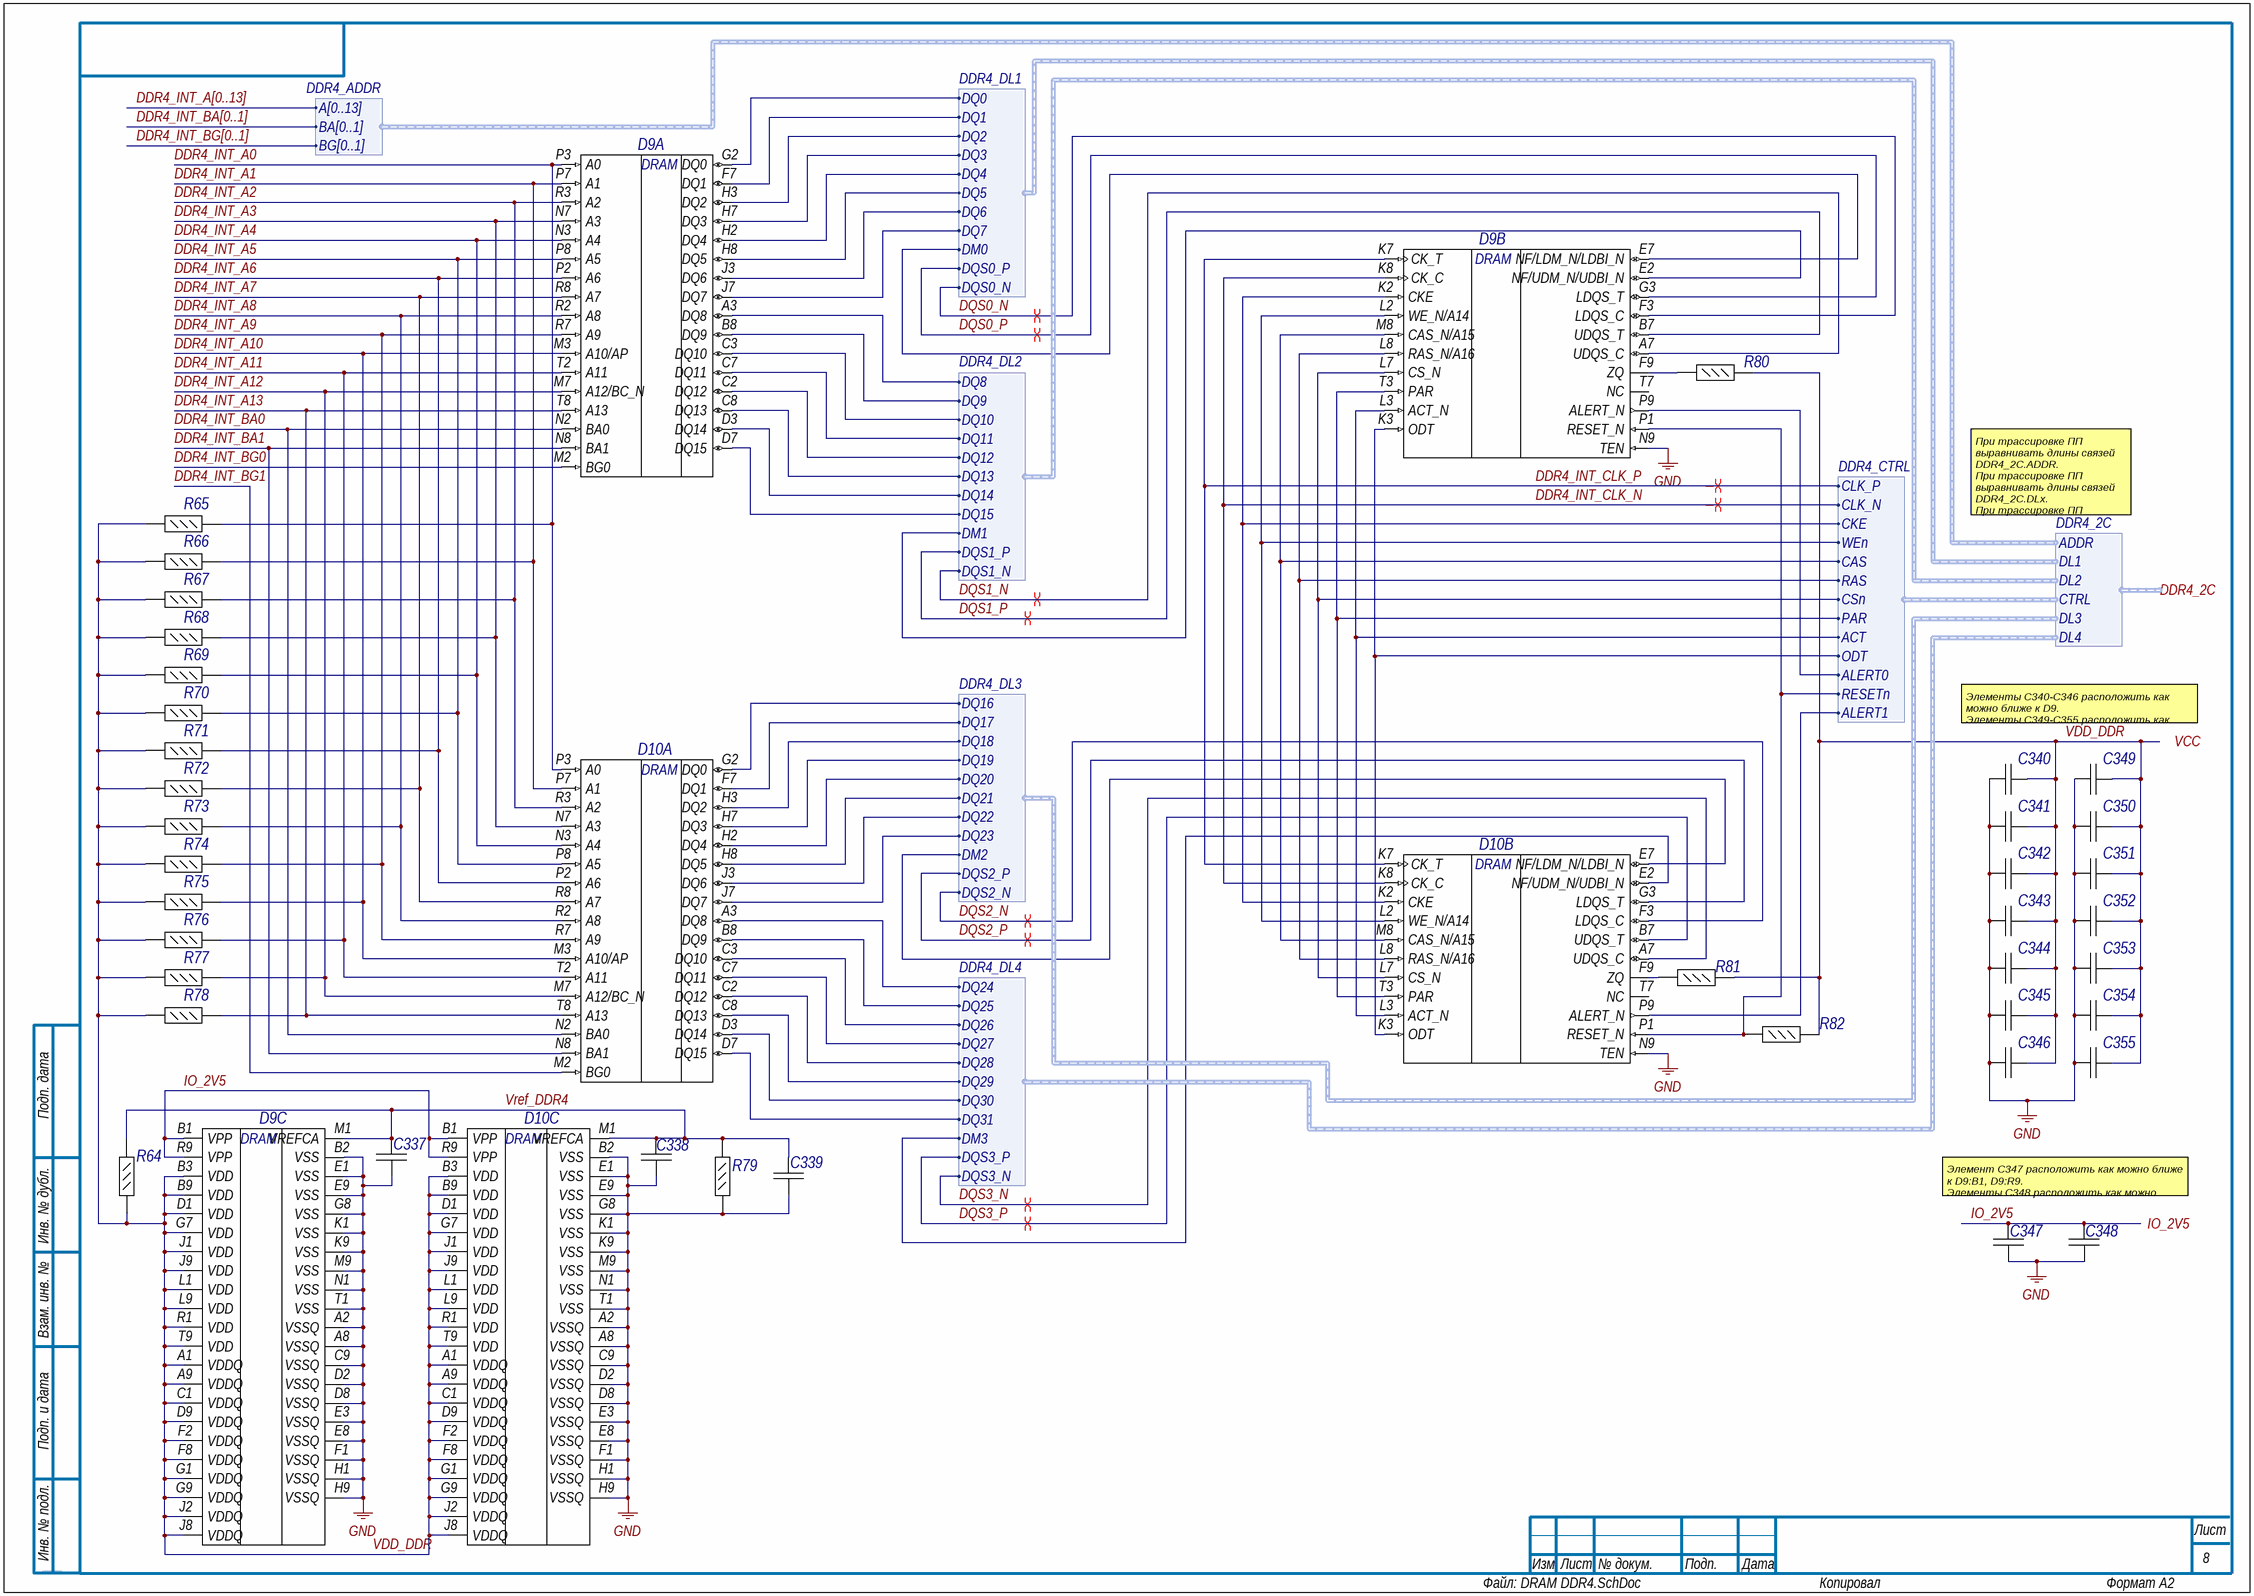
[diagram p3: DRAM DDR4.SchDoc]

### Parts
C337  GRM033R60J104KE19D  [CAPC0603X33X15LL03T05]  (value not drawn)
C338  GRM033R60J104KE19D  [CAPC0603X33X15LL03T05]  (value not drawn)
C339  GRM033R60J104KE19D  [CAPC0603X33X15LL03T05]  (value not drawn)
C340  GRM033R60J104KE19D  [CAPC0603X33X15LL03T05]  (value not drawn)
C341  GRM033R60J104KE19D  [CAPC0603X33X15LL03T05]  (value not drawn)
C342  GRM033R60J104KE19D  [CAPC0603X33X15LL03T05]  (value not drawn)
C343  GRM033R60J104KE19D  [CAPC0603X33X15LL03T05]  (value not drawn)
C344  GRM033R60J104KE19D  [CAPC0603X33X15LL03T05]  (value not drawn)
C345  GRM033R60J104KE19D  [CAPC0603X33X15LL03T05]  (value not drawn)
C346  GRM033R60J104KE19D  [CAPC0603X33X15LL03T05]  (value not drawn)
C347  GRM033R60J104KE19D  [CAPC0603X33X15LL03T05]  (value not drawn)
C348  GRM033R60J104KE19D  [CAPC0603X33X15LL03T05]  (value not drawn)
C349  GRM033R60J104KE19D  [CAPC0603X33X15LL03T05]  (value not drawn)
C350  GRM033R60J104KE19D  [CAPC0603X33X15LL03T05]  (value not drawn)
C351  GRM033R60J104KE19D  [CAPC0603X33X15LL03T05]  (value not drawn)
C352  GRM033R60J104KE19D  [CAPC0603X33X15LL03T05]  (value not drawn)
C353  GRM033R60J104KE19D  [CAPC0603X33X15LL03T05]  (value not drawn)
C354  GRM033R60J104KE19D  [CAPC0603X33X15LL03T05]  (value not drawn)
C355  GRM033R60J104KE19D  [CAPC0603X33X15LL03T05]  (value not drawn)
D9  MT40A512M16LY-107E  [MICT-LY-96_A]  (value not drawn)  (parts A,B,C of 3)
D10  MT40A512M16LY-107E  [MICT-LY-96_A]  (value not drawn)  (parts A,B,C of 3)
R64  ERJ-2RKF2400X  [RESC1005X40X25LL05T05]  (value not drawn)
R65  RC0402JR-0739RL  [RESC1005X40X25LL05T05]  (value not drawn)
R66  RC0402JR-0739RL  [RESC1005X40X25LL05T05]  (value not drawn)
R67  RC0402JR-0739RL  [RESC1005X40X25LL05T05]  (value not drawn)
R68  RC0402JR-0739RL  [RESC1005X40X25LL05T05]  (value not drawn)
R69  RC0402JR-0739RL  [RESC1005X40X25LL05T05]  (value not drawn)
R70  RC0402JR-0739RL  [RESC1005X40X25LL05T05]  (value not drawn)
R71  RC0402JR-0739RL  [RESC1005X40X25LL05T05]  (value not drawn)
R72  RC0402JR-0739RL  [RESC1005X40X25LL05T05]  (value not drawn)
R73  RC0402JR-0739RL  [RESC1005X40X25LL05T05]  (value not drawn)
R74  RC0402JR-0739RL  [RESC1005X40X25LL05T05]  (value not drawn)
R75  RC0402JR-0739RL  [RESC1005X40X25LL05T05]  (value not drawn)
R76  RC0402JR-0739RL  [RESC1005X40X25LL05T05]  (value not drawn)
R77  RC0402JR-0739RL  [RESC1005X40X25LL05T05]  (value not drawn)
R78  RC0402JR-0739RL  [RESC1005X40X25LL05T05]  (value not drawn)
R79  ERJ-2RKF2400X  [RESC1005X40X25LL05T05]  (value not drawn)
R80  ERJ-2RKF2400X  [RESC1005X40X25LL05T05]  (value not drawn)
R81  ERJ-2RKF2400X  [RESC1005X40X25LL05T05]  (value not drawn)
R82  ERJ-2RKF2001X  [RESC1005X40X25LL05T05]  (value not drawn)

### Ports
DDR4_2C (harness DDR4_2C), IO_2V5, VCC

### Harnesses
DDR4_CTRL: CLK_P, CLK_N, CKE, WEn, CAS, RAS, CSn, PAR, ACT, ODT, ALERT0, RESETn, ALERT1
DDR4_ADDR: A[0..13], BA[0..1], BG[0..1]
DDR4_DL1: DQ0, DQ1, DQ2, DQ3, DQ4, DQ5, DQ6, DQ7, DM0, DQS0_P, DQS0_N
DDR4_DL2: DQ8, DQ9, DQ10, DQ11, DQ12, DQ13, DQ14, DQ15, DM1, DQS1_P, DQS1_N
DDR4_DL3: DQ16, DQ17, DQ18, DQ19, DQ20, DQ21, DQ22, DQ23, DM2, DQS2_P, DQS2_N
DDR4_DL4: DQ24, DQ25, DQ26, DQ27, DQ28, DQ29, DQ30, DQ31, DM3, DQS3_P, DQS3_N
DDR4_2C: ADDR, CTRL, DL1, DL2, DL3, DL4

### Nets
GND: C337.1 C338.1 C339.1 C340.1 C341.1 C342.1 C343.1 C344.1 C345.1 C346.1 C347.1 C348.1 C349.1 C350.1 C351.1 C352.1 C353.1 C354.1 C355.1 D9.A2(VSSQ) D9.A8(VSSQ) D9.B2(VSS) D9.C9(VSSQ) D9.D2(VSSQ) D9.D8(VSSQ) D9.E1(VSS) D9.E3(VSSQ) D9.E8(VSSQ) D9.E9(VSS) D9.F1(VSSQ) D9.G8(VSS) D9.H1(VSSQ) D9.H9(VSSQ) D9.K1(VSS) D9.K9(VSS) D9.M9(VSS) D9.N1(VSS) D9.N9(TEN) D9.T1(VSS) D10.A2(VSSQ) D10.A8(VSSQ) D10.B2(VSS) D10.C9(VSSQ) D10.D2(VSSQ) D10.D8(VSSQ) D10.E1(VSS) D10.E3(VSSQ) D10.E8(VSSQ) D10.E9(VSS) D10.F1(VSSQ) D10.G8(VSS) D10.H1(VSSQ) D10.H9(VSSQ) D10.K1(VSS) D10.K9(VSS) D10.M9(VSS) D10.N1(VSS) D10.N9(TEN) D10.T1(VSS) R79.1
DDR4_INT_A0: D9.P3(A0) D10.P3(A0) R65.2  [project net DDR4_INT_A0_8]
DDR4_INT_A1: D9.P7(A1) D10.P7(A1) R66.2  [project net DDR4_INT_A1_8]
DDR4_INT_A2: D9.R3(A2) D10.R3(A2) R67.2  [project net DDR4_INT_A2_8]
DDR4_INT_A3: D9.N7(A3) D10.N7(A3) R68.2  [project net DDR4_INT_A3_8]
DDR4_INT_A4: D9.N3(A4) D10.N3(A4) R69.2  [project net DDR4_INT_A4_8]
DDR4_INT_A5: D9.P8(A5) D10.P8(A5) R70.2  [project net DDR4_INT_A5_8]
DDR4_INT_A6: D9.P2(A6) D10.P2(A6) R71.2  [project net DDR4_INT_A6_8]
DDR4_INT_A7: D9.R8(A7) D10.R8(A7) R72.2  [project net DDR4_INT_A7_8]
DDR4_INT_A8: D9.R2(A8) D10.R2(A8) R73.2  [project net DDR4_INT_A8_8]
DDR4_INT_A9: D9.R7(A9) D10.R7(A9) R74.2  [project net DDR4_INT_A9_8]
DDR4_INT_A10: D9.M3(A10/AP) D10.M3(A10/AP) R75.2  [project net DDR4_INT_A10_8]
DDR4_INT_A11: D9.T2(A11) D10.T2(A11) R76.2  [project net DDR4_INT_A11_8]
DDR4_INT_A12: D9.M7(A12/BC_N) D10.M7(A12/BC_N) R77.2  [project net DDR4_INT_A12_8]
DDR4_INT_A13: D9.T8(A13) D10.T8(A13) R78.2  [project net DDR4_INT_A13_8]
DDR4_INT_BA0: D9.N2(BA0) D10.N2(BA0)  [project net DDR4_INT_BA0_8]
DDR4_INT_BA1: D9.N8(BA1) D10.N8(BA1)  [project net DDR4_INT_BA1_8]
DDR4_INT_BG0: D9.M2(BG0)  [project net DDR4_INT_BG0_8]
DDR4_INT_BG1: D10.M2(BG0)  [project net DDR4_INT_BG1_8]
DDR4_INT_CLK_N: D9.K8(CK_C) D10.K8(CK_C) ; harness DDR4_CTRL.CLK_N
DDR4_INT_CLK_P: D9.K7(CK_T) D10.K7(CK_T) ; harness DDR4_CTRL.CLK_P
DQS0_N: D9.F3(LDQS_C) ; harness DDR4_DL1.DQS0_N
DQS0_P: D9.G3(LDQS_T) ; harness DDR4_DL1.DQS0_P
DQS1_N: D9.A7(UDQS_C) ; harness DDR4_DL2.DQS1_N
DQS1_P: D9.B7(UDQS_T) ; harness DDR4_DL2.DQS1_P
DQS2_N: D10.F3(LDQS_C) ; harness DDR4_DL3.DQS2_N
DQS2_P: D10.G3(LDQS_T) ; harness DDR4_DL3.DQS2_P
DQS3_N: D10.A7(UDQS_C) ; harness DDR4_DL4.DQS3_N
DQS3_P: D10.B7(UDQS_T) ; harness DDR4_DL4.DQS3_P
IO_2V5: C347.2 C348.2 D9.B1(VPP) D9.R9(VPP) D10.B1(VPP) D10.R9(VPP) ; port IO_2V5
VDD_DDR: C340.2 C341.2 C342.2 C343.2 C344.2 C345.2 C346.2 C349.2 C350.2 C351.2 C352.2 C353.2 C354.2 C355.2 D9.A1(VDDQ) D9.A9(VDDQ) D9.B3(VDD) D9.B9(VDD) D9.C1(VDDQ) D9.D1(VDD) D9.D9(VDDQ) D9.F2(VDDQ) D9.F8(VDDQ) D9.G1(VDDQ) D9.G7(VDD) D9.G9(VDDQ) D9.J1(VDD) D9.J2(VDDQ) D9.J8(VDDQ) D9.J9(VDD) D9.L1(VDD) D9.L9(VDD) D9.R1(VDD) D9.T9(VDD) D10.A1(VDDQ) D10.A9(VDDQ) D10.B3(VDD) D10.B9(VDD) D10.C1(VDDQ) D10.D1(VDD) D10.D9(VDDQ) D10.F2(VDDQ) D10.F8(VDDQ) D10.G1(VDDQ) D10.G7(VDD) D10.G9(VDDQ) D10.J1(VDD) D10.J2(VDDQ) D10.J8(VDDQ) D10.J9(VDD) D10.L1(VDD) D10.L9(VDD) D10.R1(VDD) D10.T9(VDD) R64.1 R65.1 R66.1 R67.1 R68.1 R69.1 R70.1 R71.1 R72.1 R73.1 R74.1 R75.1 R76.1 R77.1 R78.1 R80.2 R81.2 R82.2 ; port VCC  [project net DDR4VCC]
Vref_DDR4: C337.2 C338.2 C339.2 D9.M1(VREFCA) D10.M1(VREFCA) R64.2 R79.2  [project net Vref_DDR4_8]
NetD9_A3: D9.A3(DQ8) ; harness DDR4_DL2.DQ8
NetD9_B8: D9.B8(DQ9) ; harness DDR4_DL2.DQ9
NetD9_C2: D9.C2(DQ12) ; harness DDR4_DL2.DQ12
NetD9_C3: D9.C3(DQ10) ; harness DDR4_DL2.DQ10
NetD9_C7: D9.C7(DQ11) ; harness DDR4_DL2.DQ11
NetD9_C8: D9.C8(DQ13) ; harness DDR4_DL2.DQ13
NetD9_D3: D9.D3(DQ14) ; harness DDR4_DL2.DQ14
NetD9_D7: D9.D7(DQ15) ; harness DDR4_DL2.DQ15
NetD9_E2: D9.E2(NF/UDM_N/UDBI_N) ; harness DDR4_DL2.DM1
NetD9_E7: D9.E7(NF/LDM_N/LDBI_N) ; harness DDR4_DL1.DM0
NetD9_F7: D9.F7(DQ1) ; harness DDR4_DL1.DQ1
NetD9_F9: D9.F9(ZQ) R80.1
NetD9_G2: D9.G2(DQ0) ; harness DDR4_DL1.DQ0
NetD9_H2: D9.H2(DQ4) ; harness DDR4_DL1.DQ4
NetD9_H3: D9.H3(DQ2) ; harness DDR4_DL1.DQ2
NetD9_H7: D9.H7(DQ3) ; harness DDR4_DL1.DQ3
NetD9_H8: D9.H8(DQ5) ; harness DDR4_DL1.DQ5
NetD9_J3: D9.J3(DQ6) ; harness DDR4_DL1.DQ6
NetD9_J7: D9.J7(DQ7) ; harness DDR4_DL1.DQ7
NetD9_K2: D9.K2(CKE) D10.K2(CKE) ; harness DDR4_CTRL.CKE
NetD9_K3: D9.K3(ODT) D10.K3(ODT) ; harness DDR4_CTRL.ODT
NetD9_L2: D9.L2(WE_N/A14) D10.L2(WE_N/A14) ; harness DDR4_CTRL.WEn
NetD9_L3: D9.L3(ACT_N) D10.L3(ACT_N) ; harness DDR4_CTRL.ACT
NetD9_L7: D9.L7(CS_N) D10.L7(CS_N) ; harness DDR4_CTRL.CSn
NetD9_L8: D9.L8(RAS_N/A16) D10.L8(RAS_N/A16) ; harness DDR4_CTRL.RAS
NetD9_M8: D9.M8(CAS_N/A15) D10.M8(CAS_N/A15) ; harness DDR4_CTRL.CAS
NetD9_P1: D9.P1(RESET_N) D10.P1(RESET_N) R82.1 ; harness DDR4_CTRL.RESETn
NetD9_P9: D9.P9(ALERT_N) ; harness DDR4_CTRL.ALERT0
NetD9_T3: D9.T3(PAR) D10.T3(PAR) ; harness DDR4_CTRL.PAR
NetD10_A3: D10.A3(DQ8) ; harness DDR4_DL4.DQ24
NetD10_B8: D10.B8(DQ9) ; harness DDR4_DL4.DQ25
NetD10_C2: D10.C2(DQ12) ; harness DDR4_DL4.DQ28
NetD10_C3: D10.C3(DQ10) ; harness DDR4_DL4.DQ26
NetD10_C7: D10.C7(DQ11) ; harness DDR4_DL4.DQ27
NetD10_C8: D10.C8(DQ13) ; harness DDR4_DL4.DQ29
NetD10_D3: D10.D3(DQ14) ; harness DDR4_DL4.DQ30
NetD10_D7: D10.D7(DQ15) ; harness DDR4_DL4.DQ31
NetD10_E2: D10.E2(NF/UDM_N/UDBI_N) ; harness DDR4_DL4.DM3
NetD10_E7: D10.E7(NF/LDM_N/LDBI_N) ; harness DDR4_DL3.DM2
NetD10_F7: D10.F7(DQ1) ; harness DDR4_DL3.DQ17
NetD10_F9: D10.F9(ZQ) R81.1
NetD10_G2: D10.G2(DQ0) ; harness DDR4_DL3.DQ16
NetD10_H2: D10.H2(DQ4) ; harness DDR4_DL3.DQ20
NetD10_H3: D10.H3(DQ2) ; harness DDR4_DL3.DQ18
NetD10_H7: D10.H7(DQ3) ; harness DDR4_DL3.DQ19
NetD10_H8: D10.H8(DQ5) ; harness DDR4_DL3.DQ21
NetD10_J3: D10.J3(DQ6) ; harness DDR4_DL3.DQ22
NetD10_J7: D10.J7(DQ7) ; harness DDR4_DL3.DQ23
NetD10_P9: D10.P9(ALERT_N) ; harness DDR4_CTRL.ALERT1

Not connected (* = marked no-connect by the designer): D9 T7(NC); D10 T7(NC)

### Buses and harness runs
bus DDR4_INT_A[0..13]
bus DDR4_INT_BA[0..1]
bus DDR4_INT_BG[0..1]

### Layout directives
differential pair: DDR4_INT_CLK_N, DDR4_INT_CLK_P, DQS0_N, DQS0_P, DQS1_N, DQS1_P, DQS2_N, DQS2_P, DQS3_N, DQS3_P

### Notes on the sheet
- При трассировке ПП выравнивать длины связей DDR4_2C.ADDR.
  При трассировке ПП выравнивать длины связей DDR4_2C.DLx.
  При трассировке ПП выравнивать длины связей DDR4_2C.CTRL.
- Элементы C340-C346 расположить как можно ближе к D9.
  Элементы C349-C355 расположить как можно ближе к D10.
- Элемент C347 расположить как можно ближе к D9:B1, D9:R9.
  Элементы C348 расположить как можно ближе к D10:B1, D10:R9.
- Подп. дата
- Инв. № дубл.
- Взам. инв. №
- Подп. и дата
- Инв. № подл.
- Изм.
- Лист
- № докум.
- Подп.
- Дата
- ALTIUM GOSTBOM2.0 KEV
- Файл:
- Копировал
- Формат А2
- (in symbol E114, part A) DRAM
- (in symbol E114, part B) DRAM
- (in symbol E114, part C) DRAM